# EAGLE design Display (EAGLE 6.5.0)
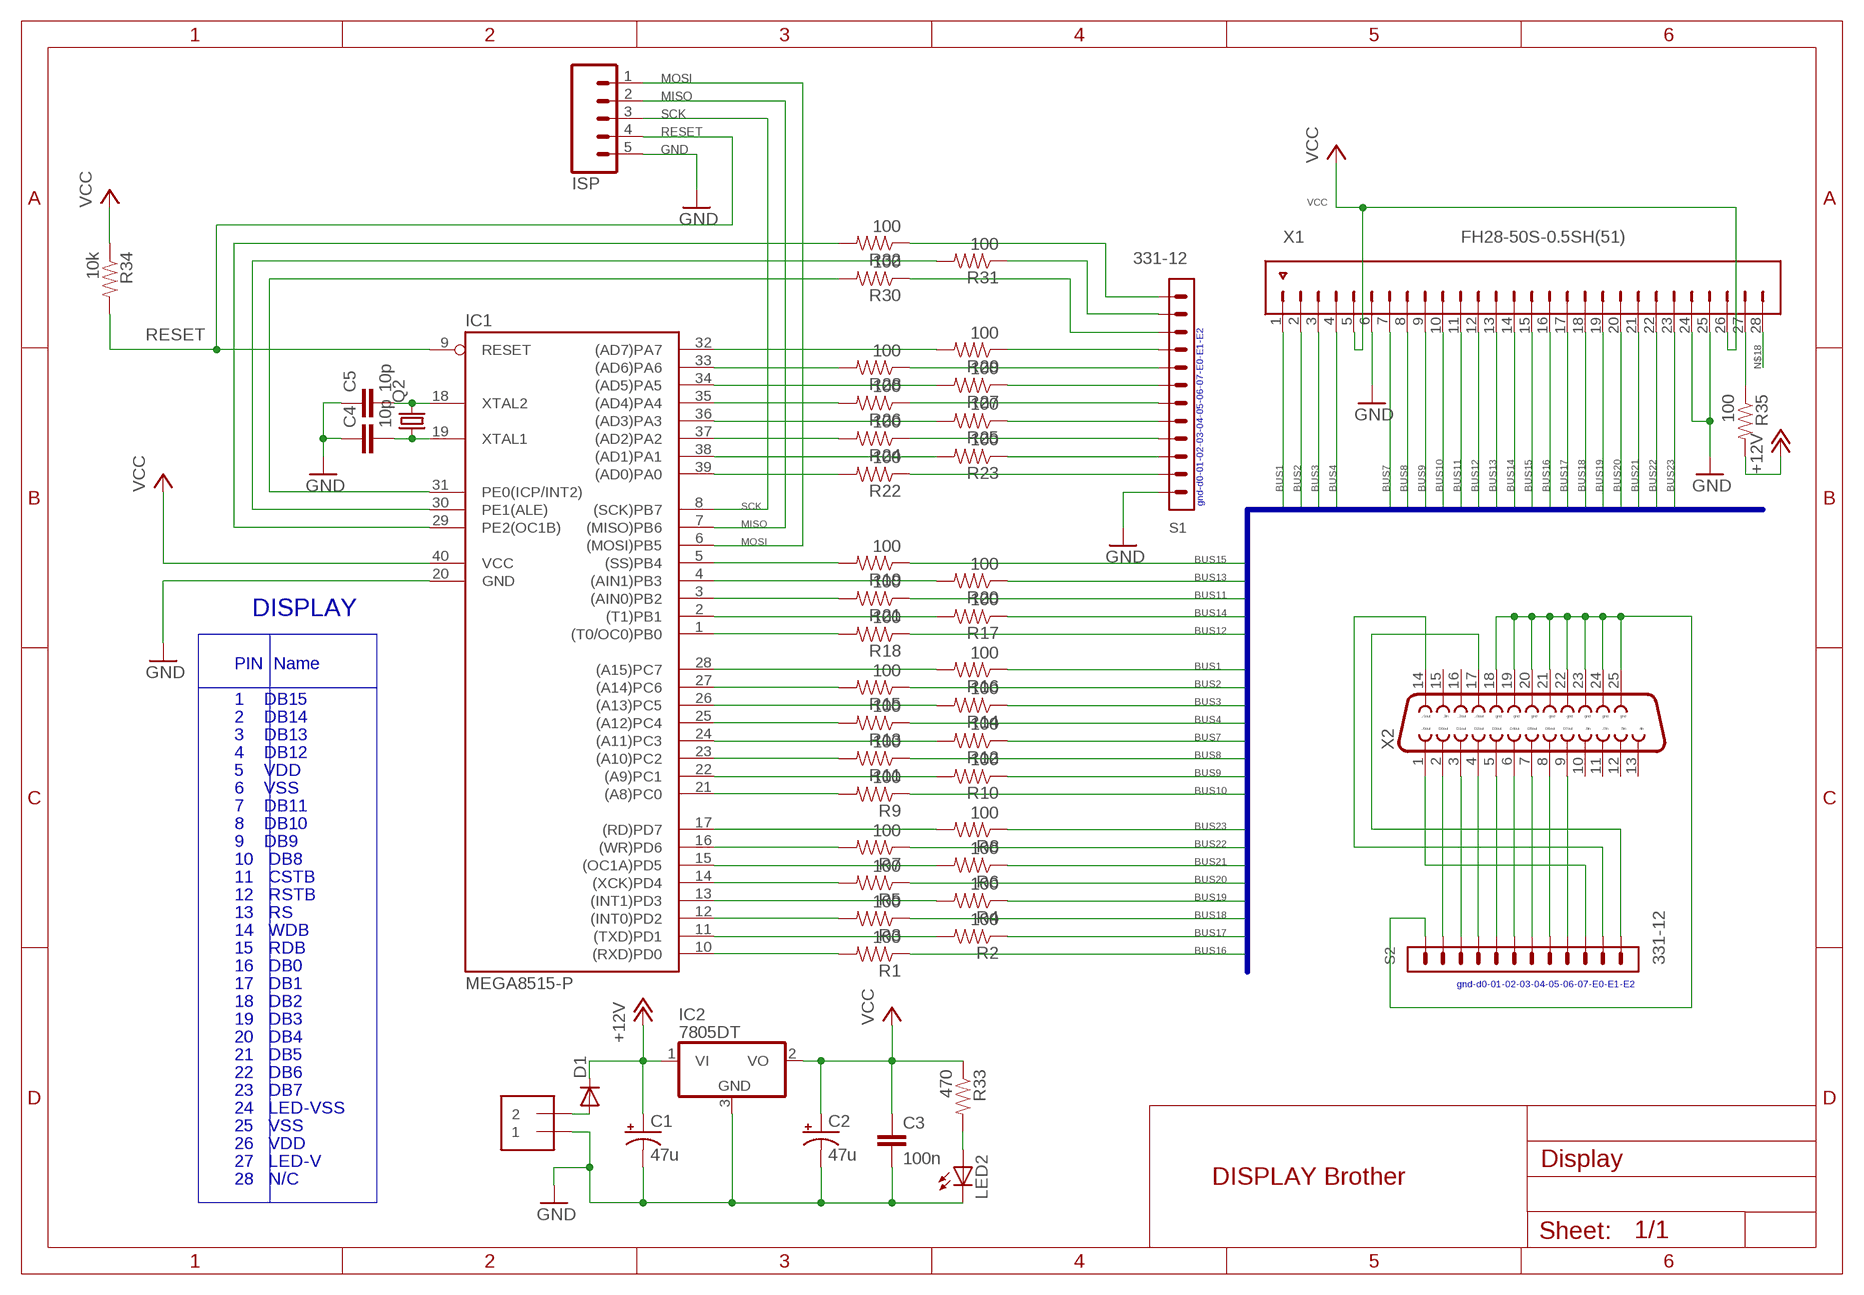
[diagram p0: schematic, sheet 1]

## Parts
C1  47u  CAP_POL1206-KIT  [EIA3216-KIT]
C2  47u  CAP_POL1206-KIT  [EIA3216-KIT]
C3  100n  CAP0805  [0805]
C4  10p  CAP0805  [0805]
C5  10p  CAP0805  [0805]
D1  DIODESMA-KIT  [SMA-DIODE-KIT]
IC1  MEGA8515-P  [DIL40]
IC2  7805DT  [TO252]
ISP  M05PTH_LONGPADS  [1X05_LONGPADS]
J2  1X2-3.5MM  [1X2-3.5MM]
LED2  LED3MM  [LED3MM]
Q2  CRYSTALHC49UP  [HC49UP]
R1  100  RESISTOR0805-RES  [0805]
R2  100  RESISTOR0805-RES  [0805]
R3  100  RESISTOR0805-RES  [0805]
R4  100  RESISTOR0805-RES  [0805]
R5  100  RESISTOR0805-RES  [0805]
R6  100  RESISTOR0805-RES  [0805]
R7  100  RESISTOR0805-RES  [0805]
R8  100  RESISTOR0805-RES  [0805]
R9  100  RESISTOR0805-RES  [0805]
R10  100  RESISTOR0805-RES  [0805]
R11  100  RESISTOR0805-RES  [0805]
R12  100  RESISTOR0805-RES  [0805]
R13  100  RESISTOR0805-RES  [0805]
R14  100  RESISTOR0805-RES  [0805]
R15  100  RESISTOR0805-RES  [0805]
R16  100  RESISTOR0805-RES  [0805]
R17  100  RESISTOR0805-RES  [0805]
R18  100  RESISTOR0805-RES  [0805]
R19  100  RESISTOR0805-RES  [0805]
R20  100  RESISTOR0805-RES  [0805]
R21  100  RESISTOR0805-RES  [0805]
R22  100  RESISTOR0805-RES  [0805]
R23  100  RESISTOR0805-RES  [0805]
R24  100  RESISTOR0805-RES  [0805]
R25  100  RESISTOR0805-RES  [0805]
R26  100  RESISTOR0805-RES  [0805]
R27  100  RESISTOR0805-RES  [0805]
R28  100  RESISTOR0805-RES  [0805]
R29  100  RESISTOR0805-RES  [0805]
R30  100  RESISTOR0805-RES  [0805]
R31  100  RESISTOR0805-RES  [0805]
R32  100  RESISTOR0805-RES  [0805]
R33  470  RESISTOR0805-RES  [0805]
R34  10k  RESISTOR0805-RES  [0805]
R35  100  RESISTOR0805-RES  [0805]
S1  331-12  [331-12]
S2  331-12  [331-12]
X1  FH28-50S-0.5SH(51)  [FH28-50S-0.5SH(51)]
X2  F25D  [F25D]

## Nets
+12V [+12V]: C1.A(+) D1.C IC2.1(VI) R35.2
BUS1: R16.1 X1.1
BUS2: R15.1 X1.2
BUS3: R14.1 X1.3
BUS4: R13.1 X1.4
BUS7: R12.1 X1.7
BUS8: R11.1 X1.8
BUS9: R10.1 X1.9
BUS10: R9.1 X1.10
BUS11: R21.1 X1.11
BUS12: R18.1 X1.12
BUS13: R20.1 X1.13
BUS14: R17.1 X1.14
BUS15: R19.1 X1.15
BUS16: R1.1 X1.16
BUS17: R2.1 X1.17
BUS18: R3.1 X1.18
BUS19: R4.1 X1.19
BUS20: R5.1 X1.20
BUS21: R6.1 X1.21
BUS22: R7.1 X1.22
BUS23: R8.1 X1.23
BUS-E0: IC1.31(PE0(ICP/INT2)) R30.2
BUS-E1: IC1.30(PE1(ALE)) R31.2
BUS-E2: IC1.29(PE2(OC1B)) R32.2
GND [GND]: C1.C(-) C2.C(-) C3.2 C4.1 C5.1 IC1.20(GND) IC2.3(GND) ISP.5 J2.1 LED2.K(C) S1.1 X1.6 X1.24 X1.25
GND3: S2.1 X2.18 X2.19 X2.20 X2.21 X2.22 X2.23 X2.24 X2.25
MISO: IC1.7((MISO)PB6) ISP.2
MOSI: IC1.6((MOSI)PB5) ISP.1
N$1: LED2.A R33.2
N$2: IC1.10((RXD)PD0) R1.2
N$3: IC1.12((INT0)PD2) R3.2
N$4: IC1.14((XCK)PD4) R5.2
N$5: IC1.16((WR)PD6) R7.2
N$6: IC1.17((RD)PD7) R8.2
N$7: IC1.15((OC1A)PD5) R6.2
N$8: IC1.13((INT1)PD3) R4.2
N$9: IC1.11((TXD)PD1) R2.2
N$10: IC1.28((A15)PC7) R16.2
N$11: IC1.27((A14)PC6) R15.2
N$12: IC1.25((A12)PC4) R13.2
N$13: IC1.23((A10)PC2) R11.2
N$14: IC1.21((A8)PC0) R9.2
N$15: IC1.22((A9)PC1) R10.2
N$16: IC1.24((A11)PC3) R12.2
N$17: IC1.26((A13)PC5) R14.2
N$18: X1.28
N$19: IC1.3((AIN0)PB2) R21.2
N$20: IC1.1((T0/OC0)PB0) R18.2
N$21: IC1.4((AIN1)PB3) R20.2
N$22: C4.2 IC1.19(XTAL1) Q2.1
N$23: S2.2 X2.2
N$24: S2.3 X2.3
N$25: IC1.2((T1)PB1) R17.2
N$26: S2.4 X2.4
N$27: S2.5 X2.5
N$28: S2.6 X2.6
N$29: S2.7 X2.7
N$30: IC1.5((SS)PB4) R19.2
N$31: R22.1 S1.2
N$32: IC1.38((AD1)PA1) R23.2
N$33: R24.1 S1.4
N$34: S2.8 X2.8
N$35: IC1.36((AD3)PA3) R25.2
N$36: S2.10 X2.1
N$37: R26.1 S1.6
N$38: S2.11 X2.14
N$39: IC1.34((AD5)PA5) R27.2
N$40: R28.1 S1.8
N$41: IC1.32((AD7)PA7) R29.2
N$42: IC1.39((AD0)PA0) R22.2
N$43: R23.1 S1.3
N$44: IC1.37((AD2)PA2) R24.2
N$45: R25.1 S1.5
N$46: IC1.35((AD4)PA4) R26.2
N$47: R27.1 S1.7
N$48: IC1.33((AD6)PA6) R28.2
N$49: R29.1 S1.9
N$50: R30.1 S1.10
N$51: R32.1 S1.12
N$52: R31.1 S1.11
N$53 [+12V]: D1.A J2.2
N$55: S2.9 X2.9
N$56: C5.2 IC1.18(XTAL2) Q2.2
N$57: S2.12 X2.17
N$58 [+12V]: R35.1 X1.27
RESET: IC1.9(RESET) ISP.4 R34.2
SCK: IC1.8((SCK)PB7) ISP.3
VCC [VCC]: C2.A(+) C3.1 IC1.40(VCC) IC2.2(VO) R33.1 R34.1 X1.5 X1.26
Unconnected: X2.10 X2.11 X2.12 X2.13 X2.15 X2.16

## Buses
B$1
BUS[1..28]

## Notes on the sheet
- gnd-d0-01-02-03-04-05-06-07-E0-E1-E2
- DISPLAY
- PIN  Name
- 1    DB15
- 2    DB14
- 3    DB13
- 4    DB12
- 5    VDD
- 6    VSS
- 7    DB11
- 8    DB10
- 9    DB9
- 10   DB8
- 11   CSTB
- 12   RSTB
- 13   RS
- 14   WDB
- 15   RDB
- 16   DB0
- gnd-d0-01-02-03-04-05-06-07-E0-E1-E2
- 17   DB1
- 18   DB2
- 19   DB3
- 20   DB4
- 21   DB5
- 22   DB6
- 23   DB7
- 24   LED-VSS
- 25   VSS
- 26   VDD
- 27   LED-V
- 28   N/C | DISPLAY Brother

## Library data of the parts
C1 C2 = SparkFun:CAP_POL: Capacitor Polarized These are standard SMD and PTH capacitors. Normally 10uF, 47uF, and 100uF in electrolytic and tantalum varieties. Always verify the external diameter of the through hole cap, it varies with capacity, voltage, and manufacturer. The EIA devices should be standard.
C3-C5 = SparkFun:CAP: Capacitor Standard 0603 ceramic capacitor, and 0.1" leaded capacitor.
D1 = SparkFun:DIODE: Diode These are standard reverse protection diodes and small signal diodes. SMA package can handle up to about 1A. SOD-323 can handle about 200mA. What the SOD-323 package when ordering, there are some mfgs out there that are 5-pin packages.
IC1 = atmel:MEGA8515-P: MICROCONTROLLER 8 Kbytes FLASH 512 bytes SRAM 512 bytes EEPROM USART 8-channel 10 bit ADC Source: avr.lbr; MPN: ATMEGA8515-16PU; OC_FARNELL: 9171401; OC_NEWARK: 01M6905
IC2 = linear:78*: Positive VOLTAGE REGULATOR Source: http://cache.national.com/ds/LM/LM78L05.pdf http://www.fairchildsemi.com/ds/LM/LM7805.pdf
ISP = SparkFun:M05: Header 5 Standard 5-pin 0.1" header. Use with straight break away headers (SKU : PRT-00116), right angle break away headers (PRT-00553), swiss pins (PRT-00743), machine pins (PRT-00117), and female headers (PRT-00115). Molex polarized connector foot print use with SKU : PRT-08230 with associated crimp pins and housings.
J2 = adafruit:1X2: 3.5mm Terminal block http://www.ladyada.net/library/pcb/eaglelibrary.html
LED2 = SparkFun:LED: LEDs Standard schematic elements and footprints for 5mm, 3mm, 1206, and 0603 sized LEDs. 5mm - Spark Fun Electronics SKU : COM-00529 (and others)
Q2 = crystal:CRYSTAL: CRYSTAL; OC_FARNELL: unknown; OC_NEWARK: unknown
R1-R35 = SparkFun:RESISTOR: Resistor Basic schematic elements and footprints for 0603, 1206, and PTH resistors.
S1 S2 = con-garry:331-12
X1 = con-hirose:FH28-50S-0.5SH(51): Flexible Printed Circuit & Flexible Flat Cable ZIF Connectors 0.5 mm Pitch, 2.55 mm above the board Source: http://www.hirose.co.jp/cataloge_hp/e58618038.pdf; OC_FARNELL: unknown; OC_NEWARK: unknown
X2 = SparkFun:F25: D-SUB 25 25 Pin male connector. PCB edge mount for regular PCB thicknesses. This connector will connect directly to the back of a PC parallel port or through a normal DB25 extension cable (M/F). SKU: PRT-08287

## Net classes
0 default: width 0.203 mm
1 EN_B: width 0.4 mm
2 EN_A: width 0.4 mm
3 VCC: width 0.4 mm
4 GND: width 0.4 mm
5 +24V: width 1 mm
6 +12V: width 0.4 mm

## Board
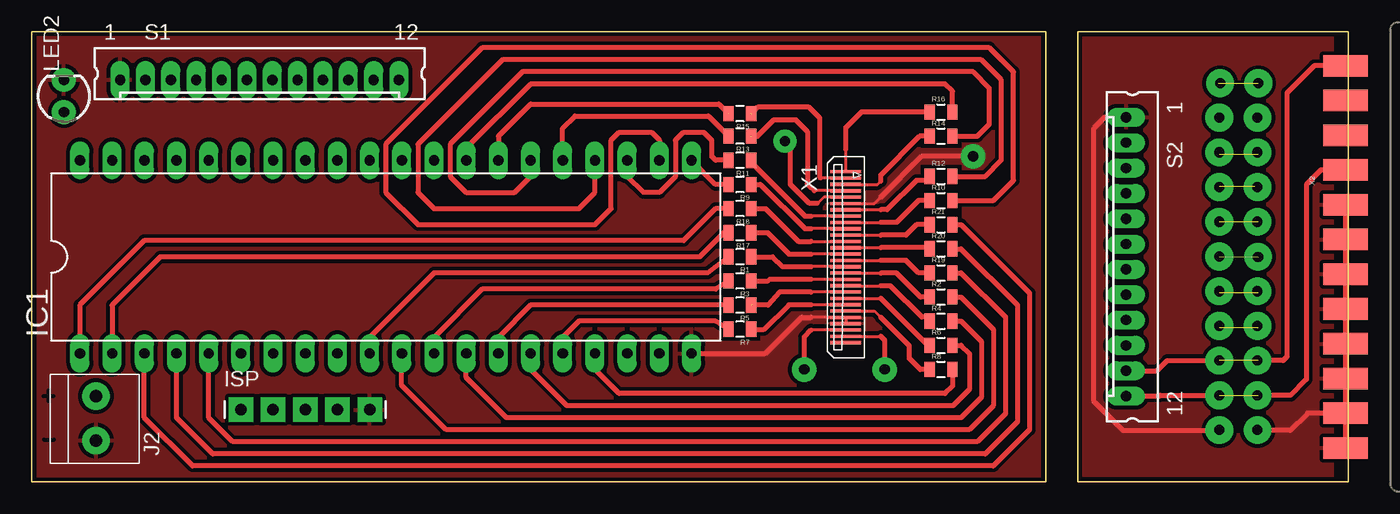
[diagram p1: board, top side]
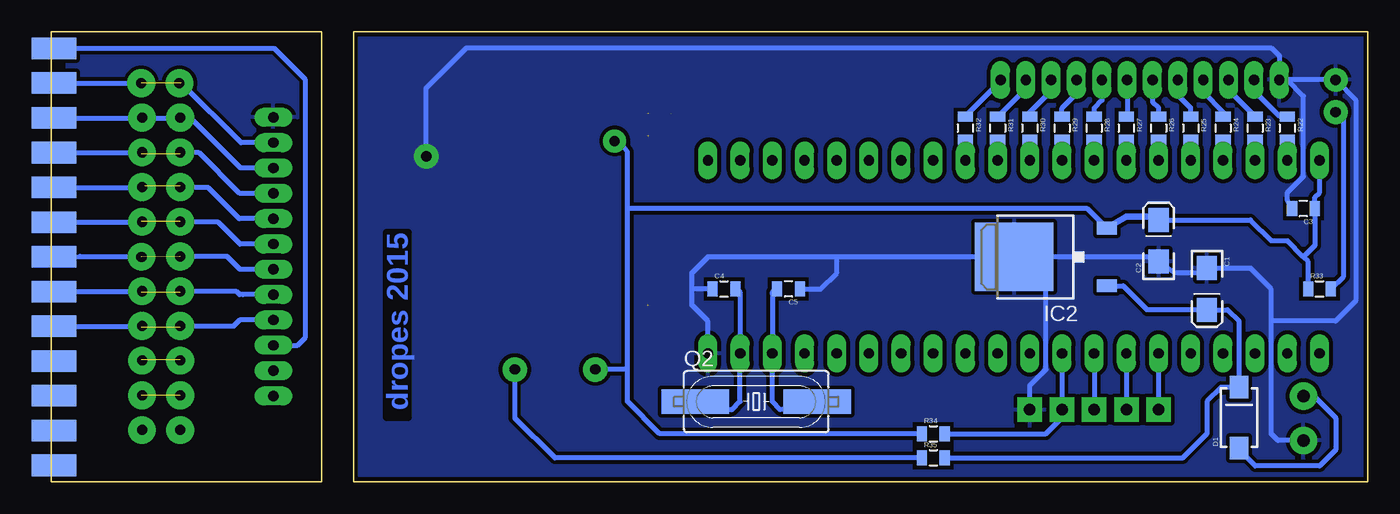
[diagram p2: board, bottom side, seen from below]

Size 103.89 x 35.56 mm. Coordinates in mm from the lower left corner, seen from the top.
Outline: 0,0 80.01,0 80.01,35.56 0,35.56 0,0
Outline: 103.89,35.56 103.89,0 82.55,0 82.55,35.56 103.89,35.56
Copper layers (1*16): Top 0.035mm / dielectric 1.5mm / Bottom 0.035mm
Design rules: minimum track width 0.4mm, minimum drill 0.8mm, track to track 0.3mm, track to pad 0.3mm, pad to pad 0.3mm, via to via 0.3mm, smd to smd 0mil, copper to edge 0.3mm, drill to drill 8mil, minimum pad ring 0.35mm, minimum via ring 0.5mm, stop-mask expansion 4mil, vias tented up to drill 0mil, thermal gap 0.3mm
tRestrict: 3 lines

### Footprints (pad centres in the part's own frame; a part is rotated, then mirrored left to right if it is on the bottom)
EIA3216-KIT = smd 1.9 x 1.6: A 1.65,0; C -1.65,0
0805 = smd 0.8 x 1.2: 1 -0.9,0; 2 0.9,0
SMA-DIODE-KIT = smd 1.77 x 1.47: A -2.4,0; C 2.4,0
DIL40 = drill 0.813 long: 1 -24.13,-7.62; 2 -21.59,-7.62; 3 -19.05,-7.62; 4 -16.51,-7.62; 5 -13.97,-7.62; 6 -11.43,-7.62; 7 -8.89,-7.62; 8 -6.35,-7.62; 9 -3.81,-7.62; 10 -1.27,-7.62; 11 1.27,-7.62; 12 3.81,-7.62; 13 6.35,-7.62; 14 8.89,-7.62; 15 11.43,-7.62; 16 13.97,-7.62; 17 16.51,-7.62; 18 19.05,-7.62; 19 21.59,-7.62; 20 24.13,-7.62; 21 24.13,7.62; 22 21.59,7.62; 23 19.05,7.62; 24 16.51,7.62; 25 13.97,7.62; 26 11.43,7.62; 27 8.89,7.62; 28 6.35,7.62; 29 3.81,7.62; 30 1.27,7.62; 31 -1.27,7.62; 32 -3.81,7.62; 33 -6.35,7.62; 34 -8.89,7.62; 35 -11.43,7.62; 36 -13.97,7.62; 37 -16.51,7.62; 38 -19.05,7.62; 39 -21.59,7.62; 40 -24.13,7.62
TO252 = smd 1 x 1.6: 1 -2.28,-4.8; 2 2.28,-4.8 | smd 5.4 x 6.2: 3 0,2.5
1X05_LONGPADS = drill 0.9 pad 1.93 square: 1 0,0; 2 2.54,0; 3 5.08,0; 4 7.62,0; 5 10.16,0
1X2-3.5MM = drill 1 pad 2.184: 1 1.8,0; 2 -1.7,0
LED3MM = drill 0.813 pad 1.88: A -1.27,0; K 1.27,0
HC49UP = smd 5.334 x 1.93: 1 -4.826,0; 2 4.826,0
331-12 = drill 0.813 long: 1 0,0; 2 2,0; 3 4,0; 4 6,0; 5 8,0; 6 10,0; 7 12,0; 8 14,0; 9 16,0; 10 18,0; 11 20,0; 12 22,0
FH28-50S-0.5SH(51) = smd 0.25 x 2.4: 1 -6.75,0; 2 -6.25,0; 3 -5.75,0; 4 -5.25,0; 5 -4.75,0; 6 -4.25,0; 7 -3.75,0; 8 -3.25,0; 9 -2.75,0; 10 -2.25,0; 11 -1.75,0; 12 -1.25,0; 13 -0.75,0; 14 -0.25,0; 15 0.25,0; 16 0.75,0; 17 1.25,0; 18 1.75,0; 19 2.25,0; 20 2.75,0; 21 3.25,0; 22 3.75,0; 23 4.25,0; 24 4.75,0; 25 5.25,0; 26 5.75,0; 27 6.25,0; 28 6.75,0
F25D = smd 1.7 x 3.5 bottom: 1 -16.459,-6.045; 2 -13.716,-6.045; 3 -10.973,-6.045; 4 -8.23,-6.045; 5 -5.486,-6.045; 6 -2.743,-6.045; 7 0,-6.045; 8 2.743,-6.045; 9 5.486,-6.045; 10 8.23,-6.045; 11 10.973,-6.045; 12 13.716,-6.045; 13 16.459,-6.045 | smd 1.7 x 3.5: 14 -15.088,-6.045; 15 -12.344,-6.045; 16 -9.601,-6.045; 17 -6.858,-6.045; 18 -4.115,-6.045; 19 -1.372,-6.045; 20 1.372,-6.045; 21 4.115,-6.045; 22 6.858,-6.045; 23 9.601,-6.045; 24 12.344,-6.045; 25 15.088,-6.045

### Placement (x,y rotation side)
C1  12.7,15.24 270 bottom
C2  16.51,19.05 90 bottom
C3  5.08,21.59 180 bottom
C4  50.8,15.24 0 bottom
C5  45.72,15.24 180 bottom
D1  10.16,5.08 90 bottom
IC1  27.94,17.78 0 top
IC2  25.4,17.78 90 bottom
ISP  16.51,5.71 0 top
J2  5.08,5.08 270 top
LED2  2.54,30.48 90 top
Q2  48.26,6.35 0 bottom
R1  55.88,17.78 180 top
R2  71.75,14.61 0 top
R3  55.88,15.88 180 top
R4  71.75,12.7 0 top
R5  55.88,13.97 180 top
R6  71.75,10.79 0 top
R7  55.88,12.06 180 top
R8  71.75,8.89 0 top
R9  55.88,23.5 180 top
R10  71.75,22.23 0 top
R11  55.88,25.4 180 top
R12  71.75,24.13 0 top
R13  55.88,27.3 180 top
R14  71.75,27.3 0 top
R15  55.88,29.08 180 top
R16  71.75,29.21 0 top
R17  55.88,19.68 180 top
R18  55.88,21.59 180 top
R19  71.75,16.51 0 top
R20  71.75,18.41 0 top
R21  71.75,20.32 0 top
R22  6.35,27.94 270 bottom
R23  8.89,27.94 270 bottom
R24  11.43,27.94 270 bottom
R25  13.97,27.94 270 bottom
R26  16.51,27.94 270 bottom
R27  19.05,27.94 270 bottom
R28  21.59,27.94 270 bottom
R29  24.13,27.94 270 bottom
R30  26.67,27.94 270 bottom
R31  29.21,27.94 270 bottom
R32  31.75,27.94 270 bottom
R33  3.81,15.24 0 bottom
R34  34.29,3.81 0 bottom
R35  34.29,1.91 0 bottom
S1  6.99,31.75 0 top
S2  86.36,28.79 270 top
X1  64.25,17.75 270 top
X2  109.73,17.78 270 top

### Tracks (layer width: path | path; a pad name or v marks a point on that pad's centre or on a via)
+12V
  Bottom 0.4: IC2.1 19.31,15.5 17.4,13.59 C1.A 11.05,13.59 10.16,12.7 D1.C 11.57,7.48 12.7,6.35 12.7,3.81 14.61,1.91 R35.2
BUS1
  Top 0.25: X1.1 64.25,26.25
  Top 0.4: 64.25,26.25 64.25,28 65.46,29.21 R16.1
BUS2  (1 unrouted)
  Top 0.25: X1.2 62.25,24
  Top 0.4: 56.77,29.08 57.28,29.59 61.34,29.59 62.17,28.76 62.17,24.08 62.25,24
BUS3
  Top 0.25: X1.3 66.75,23.5 67,23.75
  Top 0.4: 67,23.75 67,24.25 70.06,27.3 R14.1
BUS4  (1 unrouted)
  Top 0.25: X1.4 61.75,23
  Top 0.4: 56.77,27.3 57.28,27.3 58.55,28.57 60.33,28.57 61.21,27.69 61.21,23.54 61.5,23.25 61.75,23
BUS7
  Top 0.25: X1.7 67,21.5
  Top 0.4: R12.1 70.8,23.81 69.81,23.81 67.5,21.5 67,21.5
BUS8
  Top 0.25: X1.8 61.5,21
  Top 0.4: R11.1 56.78,25.22 61,21 61.5,21
BUS9
  Top 0.25: X1.9 67,20.5
  Top 0.4: R10.1 69.97,22.23 68.25,20.5 67,20.5
BUS10
  Top 0.25: X1.10 61.5,20
  Top 0.4: R9.1 57.51,23.5 61,20 61.5,20
BUS11
  Top 0.25: X1.11 67,19.5
  Top 0.4: R21.1 69.82,20.32 69,19.5 67,19.5
BUS12
  Top 0.25: 61.5,19 X1.12
  Top 0.4: R18.1 57.91,21.59 60.5,19 61.5,19
BUS13
  Top 0.25: 70.77,18.5 R20.1 | X1.13 67,18.5
  Top 0.4: R20.1 70.8,18.41 70.72,18.5 67,18.5
BUS14
  Top 0.25: X1.14 61.5,18
  Top 0.4: R17.1 58.06,19.68 59.75,18 61.5,18
BUS15
  Top 0.25: X1.15 67,17.5
  Top 0.4: R19.1 69.99,16.51 69,17.5 67,17.5
BUS16
  Top 0.25: X1.16 61.5,17
  Top 0.4: R1.1 58.47,17.78 59.25,17 61.5,17
BUS17
  Top 0.25: X1.17 67,16.5
  Top 0.4: R2.1 70.14,14.61 68.25,16.5 67,16.5
BUS18
  Top 0.25: X1.18 61.5,16
  Top 0.4: R3.1 58.1,15.88 58.25,16 61.5,16
BUS19
  Top 0.25: X1.19 67,15.5
  Top 0.4: R4.1 70.8,12.7 70.8,13.02 70.23,13.02 67.75,15.5 67,15.5
BUS20  (1 unrouted)
  Top 0.25: X1.20 61.5,15
  Top 0.4: 61.5,15 59,15 58.1,13.97 56.83,13.97
BUS21
  Top 0.25: X1.21 67,14.5
  Top 0.4: R6.1 70.7,10.79 67,14.5
BUS22
  Top 0.25: X1.22 61.5,14
  Top 0.4: R7.1 57.78,12.06 59.75,14 61.5,14
BUS23
  Top 0.25: X1.23 66.5,13.5 67,13
  Top 0.4: R8.1 70.11,8.89 69.25,9.75 69.25,10.75 67,13
BUS-E0
  Bottom 0.4: R30.2 IC1.31
BUS-E1
  Bottom 0.4: R31.2 IC1.30
BUS-E2
  Bottom 0.4: R32.2 IC1.29
GND  (via drill 0.8 pad 1.93)
  Top 0.25: X1.25 X1.24 61.5,13 | X1.6 66.5,22 67,22.5
  Top 0.4: IC1.20 57.91,10.16 60.75,13 61.5,13 | 67,22.5 70.22,25.72 v74.3,25.72
  Bottom 0.4: J2.1 7.09,3.28 7.62,3.81 7.62,12.7 | 7.62,12.7 7.62,15.24 9.27,16.89 C1.C 13.08,16.51 15.24,16.51 C2.C 17.4,17.78 25.4,17.78 25.4,15.28 | ISP.5 26.67,7.62 25.4,8.89 25.4,15.28 | 25.4,15.28 IC2.3 41.91,17.78 | 41.91,17.78 52.07,17.78 53.34,16.51 53.34,15.24 | C3.2 6.35,22.23 6.35,22.86 5.08,24.13 5.08,30.48 6.35,31.75 | 6.35,31.75 LED2.K 0.95,30.16 0.95,14.29 2.54,12.7 7.62,12.7 | 6.35,31.75 S1.1 6.99,33.66 7.62,34.29 71.12,34.29 74.3,31.11 v74.3,25.72 | IC1.20 52.07,12.7 53.34,13.97 53.34,15.24 | C5.1 43.18,15.24 41.91,16.51 41.91,17.78 | C4.1 53.34,15.24
  pour Top: 0,35.56 80.01,35.56 80.01,0 0,0
  pour Bottom: 0,35.56 80.01,35.56 80.01,0 0,0
GND3
  Top 0.4: X2.25 X2.24 | X2.24 X2.23 X2.22 X2.21 X2.20 X2.19 X2.18 | S2.1 84.67,28.79 83.82,27.94 83.82,6.35 86.11,4.06 93.73,4.06 | X2.24 100.69,5.44 99.31,4.06 96.77,4.06
  pour Bottom: 102.62,0 82.55,0 82.55,35.56 102.62,35.56
  pour Top: 82.55,0 102.62,0 102.62,35.56 82.55,35.56
MISO
  Bottom 0.4: IC1.7 ISP.2
MOSI
  Bottom 0.4: ISP.1 IC1.6
N$1
  Bottom 0.4: R33.2 1.91,16.25 1.91,28.57 LED2.A
N$2
  Top 0.4: R1.2 53.34,16.51 31.75,16.51 26.67,11.43 IC1.10
N$3
  Top 0.4: R3.2 53.98,15.24 35.56,15.24 31.75,11.43 IC1.12
N$4
  Top 0.4: R5.2 39.37,13.97 36.83,11.43 IC1.14
N$5
  Top 0.4: R7.2 53.98,12.7 43.18,12.7 41.91,11.43 IC1.16
N$6
  Top 0.4: IC1.17 44.45,8.89 46.35,6.99 72.07,6.99 72.66,7.57 R8.2
N$7
  Top 0.4: R6.2 73.34,10.79 73.98,10.16 73.98,7.3 72.71,6.03 42.23,6.03 39.37,8.89 IC1.15
N$8
  Top 0.4: R4.2 73.34,12.7 74.93,11.11 74.93,6.67 73.34,5.08 37.47,5.08 34.29,8.26 IC1.13
N$9
  Top 0.4: R2.2 73.34,14.61 75.88,12.06 75.88,6.03 73.98,4.13 32.7,4.13 29.21,7.62 IC1.11
N$10
  Top 0.4: R16.2 72.66,30.85 72.07,31.43 39.37,31.43 34.29,26.35 IC1.28
N$11  (1 unrouted)
  Top 0.4: IC1.27 36.83,27.3 39.37,29.84 54.23,29.84 R15.2
N$12
  Top 0.4: IC1.25 41.91,27.94 42.86,28.89 53.39,28.89 R13.2
N$13
  Top 0.4: R11.2 53.98,25.4 53.66,25.72 53.66,26.99 53.02,27.62 51.44,27.62 50.8,26.99 50.8,24.13 49.53,22.86 48.26,22.86 46.99,24.13 IC1.23
N$14
  Top 0.4: R9.2 53.98,23.5 IC1.21
N$15
  Top 0.4: R10.2 75.88,22.23 77.47,23.81 77.47,32.38 75.56,34.29 35.56,34.29 27.94,26.67 27.94,22.86 30.48,20.32 44.45,20.32 45.72,21.59 45.72,26.99 46.35,27.62 48.9,27.62 49.53,26.99 IC1.22
N$16
  Top 0.4: R12.2 75.25,24.13 76.52,25.4 76.52,31.75 74.93,33.34 37.15,33.34 30.48,26.67 30.48,22.86 31.75,21.59 43.18,21.59 44.45,22.86 IC1.24
N$17
  Top 0.4: R14.2 74.61,27.3 75.56,28.26 75.56,31.11 74.3,32.38 38.73,32.38 33.02,26.67 33.02,24.13 34.29,22.86 38.1,22.86 39.37,24.13 IC1.26
N$19
  Top 0.4: R21.2 73.34,20.32 78.74,14.92 78.74,4.13 75.88,1.27 12.7,1.27 8.89,5.08 IC1.3
N$20
  Top 0.4: R18.2 53.98,21.59 51.44,19.05 8.89,19.05 3.81,13.97 IC1.1
N$21
  Top 0.4: R20.2 73.34,18.41 77.79,13.97 77.79,4.76 75.25,2.22 14.29,2.22 11.43,5.08 IC1.4
N$22
  Bottom 0.4: Q2.1 50.16,5.71 49.53,6.35 IC1.19 49.53,14.87 arc-90 C4.2
N$23  (1 unrouted)
  Bottom 0.4: S2.2 88.92,26.79 93.63,31.5 | X2.2 96.77,31.5
N$24
  Bottom 0.4: S2.3 88.96,24.79 92.92,28.75 93.67,28.75 93.73,28.7 103.63,28.7 X2.3
N$25
  Top 0.4: R17.2 54.61,19.68 52.7,17.78 10.16,17.78 6.35,13.97 IC1.2
N$26  (1 unrouted)
  Bottom 0.4: S2.4 89,22.79 92.22,26.01 93.62,26.01 93.73,25.91 | X2.4 96.88,26.01 96.77,25.91
N$27  (1 unrouted)
  Bottom 0.4: S2.5 89.04,20.79 91.52,23.27 93.62,23.27 93.73,23.37 | X2.5 96.62,23.27 96.52,23.37
N$28  (1 unrouted)
  Bottom 0.4: S2.6 88.98,18.79 90.71,20.52 93.67,20.52 93.73,20.57 | X2.6 96.83,20.52 96.77,20.57
N$29  (via drill 0.8 pad 2.18)  (1 unrouted)
  Bottom 0.4: S2.7 88.99,16.79 90.01,17.81 v93.71,17.81 | X2.7 101.62,17.81 96.8,17.81 96.77,17.78
N$30
  Top 0.4: R19.2 73.34,16.51 76.83,13.02 76.83,5.4 74.61,3.17 15.88,3.17 13.97,5.08 IC1.5
N$31
  Bottom 0.4: S1.2 8.98,30.89 6.99,28.89 6.35,28.89 R22.1
N$32
  Bottom 0.4: R23.2 IC1.38
N$33
  Bottom 0.4: R24.1 11.43,29.21 12.98,30.77 S1.4
N$34  (1 unrouted)
  Bottom 0.4: S2.8 88.76,14.79 88.77,14.8 89.03,14.8 89.27,15.04 93.67,15.04 93.73,14.99 | X2.8 96.83,15.04 96.77,14.99
N$35
  Bottom 0.4: R25.2 IC1.36
N$36
  Bottom 0.4: S2.10 84.46,10.79 83.82,11.43 83.82,31.75 86.31,34.24 X2.1
N$37
  Bottom 0.4: R26.1 16.51,29.53 16.98,30 S1.6
N$38  (1 unrouted)
  Top 0.4: X2.14 101.19,32.87 99.06,30.73 99.06,9.91 98.74,9.59 96.84,9.59 96.77,9.65 | S2.11 88.8,8.79 89.6,9.59 93.66,9.59 93.73,9.65
N$39
  Bottom 0.4: R27.2 IC1.34
N$40
  Bottom 0.4: R28.1 21.59,29.53 20.98,30.13 S1.8
N$41
  Bottom 0.4: R29.2 IC1.32
N$42
  Bottom 0.4: IC1.39 R22.2
N$43
  Bottom 0.4: S1.3 10.98,30.93 R23.1
N$44
  Bottom 0.4: R24.2 IC1.37
N$45
  Bottom 0.4: R25.1 13.97,29.53 14.98,30.54 S1.5
N$46
  Bottom 0.4: R26.2 IC1.35
N$47
  Bottom 0.4: S1.7 18.98,28.91 R27.1
N$48
  Bottom 0.4: R28.2 IC1.33
N$49
  Bottom 0.4: R29.1 24.13,29.53 22.98,30.67 S1.9
N$50
  Bottom 0.4: R30.1 26.67,29.21 24.98,30.89 S1.10
N$51
  Bottom 0.4: S1.12 28.98,31.66 31.75,28.89 R32.1
N$52
  Bottom 0.4: S1.11 26.98,31.07 R31.1
N$53
  Bottom 0.4: J2.2 4.24,6.78 2.54,5.08 2.54,2.54 3.81,1.27 8.89,1.27 10.16,2.54 D1.A
N$54  (via drill 0.8 pad 2.18)
  other vias: 93.71,12.33
N$55  (1 unrouted)
  Bottom 0.4: S2.9 89.03,12.79 89.53,12.29 93.62,12.29 93.73,12.19 | X2.9 96.88,12.29 96.77,12.19
N$56
  Bottom 0.4: Q2.2 46.35,5.71 46.99,6.35 IC1.18 46.99,14.87 arc90 C5.2
N$57  (1 unrouted)
  Top 0.4: X2.17 101.73,24.64 100.58,23.5 100.58,8.09 99.35,6.85 96.78,6.85 96.77,6.86 | S2.12 88.99,6.79 89.05,6.85 93.72,6.85 93.73,6.86
N$58  (via drill 0.8 pad 1.93)
  Top 0.25: X1.27 67,11.5
  Top 0.4: v67.31,8.89 67.31,11.19 67,11.5
  Bottom 0.4: R35.1 64.14,1.91 67.31,5.08 v67.31,8.89
N$59  (via drill 0.8 pad 2.18)
  other vias: 93.71,15.07
N$60  (via drill 0.8 pad 2.18)
  other vias: 93.71,20.55
N$61  (via drill 0.8 pad 2.18)
  other vias: 93.71,23.29
N$62  (via drill 0.8 pad 2.18)
  other vias: 93.71,26.03
N$63  (via drill 0.8 pad 2.18)
  other vias: 93.78,31.5
N$64  (via drill 0.8 pad 2.18)
  other vias: 93.71,9.59
N$65  (via drill 0.8 pad 2.18)
  other vias: 93.71,6.85
N$66  (via drill 0.8 pad 2.18)
  other vias: 93.71,28.77
N$67  (via drill 0.8 pad 2.18)
  other vias: 93.71,4.11
N$69  (via drill 0.8 pad 2.18)
  other vias: 96.72,12.33
N$70  (via drill 0.8 pad 2.18)
  other vias: 96.72,15.07
N$71  (via drill 0.8 pad 2.18)
  other vias: 96.72,20.55
N$72  (via drill 0.8 pad 2.18)
  other vias: 96.72,23.29
N$73  (via drill 0.8 pad 2.18)
  other vias: 96.72,26.03
N$74  (via drill 0.8 pad 2.18)
  other vias: 96.79,31.5
N$75  (via drill 0.8 pad 2.18)
  other vias: 96.72,9.59
N$76  (via drill 0.8 pad 2.18)
  other vias: 96.72,6.85
N$77  (via drill 0.8 pad 2.18)
  other vias: 96.72,28.77
N$78  (via drill 0.8 pad 2.18)
  other vias: 96.72,4.11
N$79  (via drill 0.8 pad 2.18)
  other vias: 96.77,17.78
RESET
  Bottom 0.4: IC1.9 ISP.4 24.13,5.08 25.4,3.81 R34.2
SCK
  Bottom 0.4: IC1.8 ISP.3
VCC  (via drill 0.8 pad 0.3, 0.8 pad 1.93)
  Top 0.25: X1.26 61.5,12 | X1.5 62.5,22.5 62,22
  Top 0.4: v60.96,8.89 60.96,11.46 61.5,12 | 62,22 61.38,22 59.88,23.5 59.88,26.48 v59.44,26.92
  Bottom 0.4: IC1.40 3.81,22.86 4.18,22.49 C3.1 4.18,18.68 5.08,17.78 | C2.A 9.27,20.7 7.62,19.05 6.35,19.05 5.08,17.78 | R33.1 4.71,17.41 5.08,17.78 | 20.6,20.04 22.15,21.59 58.42,21.59 | 58.42,8.89 58.42,6.35 55.88,3.81 R34.1 | 58.42,8.89 58.42,21.59 | 58.42,8.89 v60.96,8.89 | v59.44,26.92 59.05,26.92 58.42,26.04 58.42,21.59
  Bottom 0.5: 20.6,20.04 IC2.2 19.07,20.95 16.89,20.95 C2.A

### Text on the board
Bottom: dropes 2015